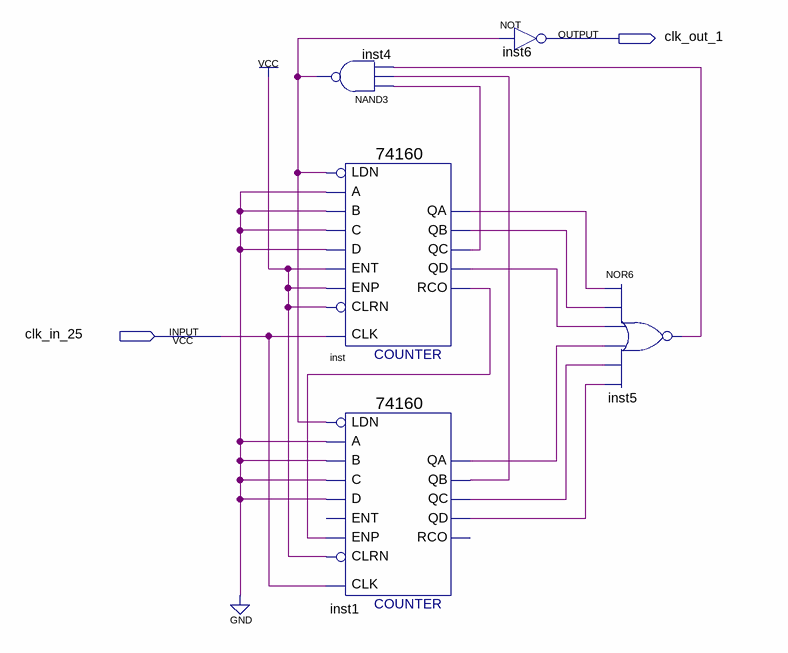
[diagram p0: schematic sheet]
// Quartus schematic cnt-25.bdf as structural Verilog: 5 symbols, 2 pins
module \cnt-25  (
  input  clk_in_25,
  output clk_out_1
);

  wire inst1_qa, inst1_qb, inst1_qc, inst1_qd, inst4_out, inst5_out, inst_qa, inst_qb, inst_qc, inst_qd,
       inst_rco;

  nand inst4 (inst4_out, inst_qc, inst1_qb, inst5_out);
  \74160  inst (
    .CLK(clk_in_25), .ENT(1'b1), .A(1'b0), .B(1'b0), .C(1'b0), .D(1'b0), .LDN(inst4_out), .ENP(1'b1),
    .CLRN(1'b1), .QD(inst_qd), .QA(inst_qa), .QB(inst_qb), .QC(inst_qc), .RCO(inst_rco));
  \74160  inst1 (
    .CLK(clk_in_25), .A(1'b0), .B(1'b0), .C(1'b0), .D(1'b0), .LDN(inst4_out), .ENP(inst_rco), .CLRN(1'b1),
    .QD(inst1_qd), .QA(inst1_qa), .QB(inst1_qb), .QC(inst1_qc));  // open: ENT, RCO
  not inst6 (clk_out_1, inst4_out);
  nor inst5 (inst5_out, inst_qa, inst_qb, inst_qd, inst1_qa, inst1_qc, inst1_qd);
endmodule
